# EAGLE design celula_de_carga (EAGLE 9.5.2)
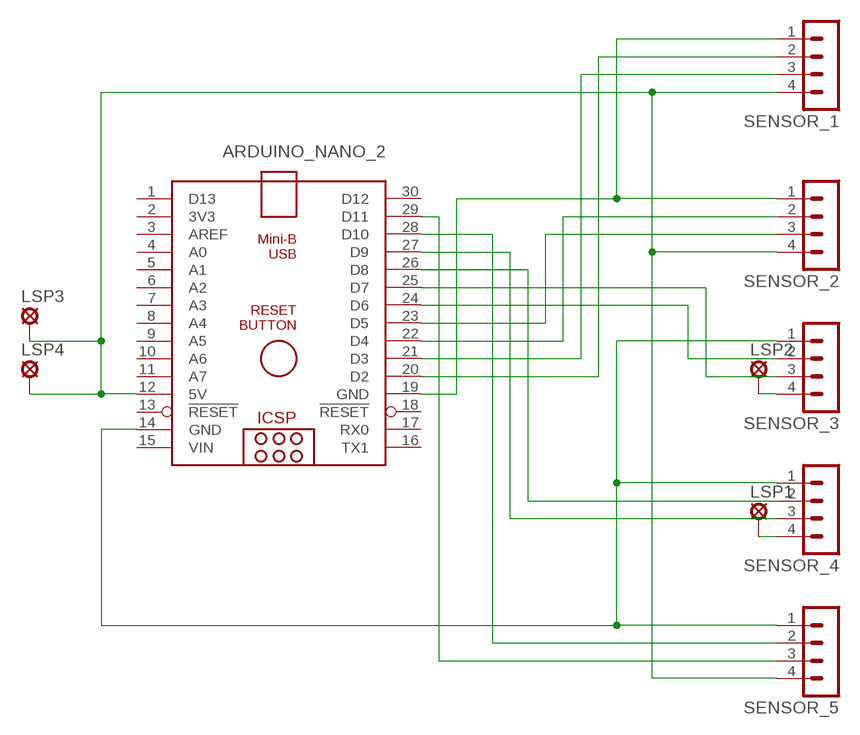
[diagram p0: schematic, sheet 1]

## Parts
ARDUINO_NANO_2  ARDUINO_NANO  [ARDUINO_NANO]
LSP1  LSP10  [LSP10]
LSP2  LSP10  [LSP10]
LSP3  LSP10  [LSP10]
LSP4  LSP10  [LSP10]
SENSOR_1  MA04-1  [MA04-1]
SENSOR_2  MA04-1  [MA04-1]
SENSOR_3  MA04-1  [MA04-1]
SENSOR_4  MA04-1  [MA04-1]
SENSOR_5  MA04-1  [MA04-1]

## Nets
N$1: ARDUINO_NANO_2.14(GND) SENSOR_3.1 SENSOR_4.1 SENSOR_5.1
N$2: ARDUINO_NANO_2.19(GND) SENSOR_1.1 SENSOR_2.1
N$3: ARDUINO_NANO_2.28(D10) SENSOR_5.2
N$4: ARDUINO_NANO_2.20(D2) SENSOR_1.2
N$5: ARDUINO_NANO_2.21(D3) SENSOR_1.3
N$6: ARDUINO_NANO_2.22(D4) SENSOR_2.2
N$7: ARDUINO_NANO_2.23(D5) SENSOR_2.3
N$8: ARDUINO_NANO_2.24(D6) SENSOR_3.2
N$9: ARDUINO_NANO_2.25(D7) SENSOR_3.3
N$10: ARDUINO_NANO_2.26(D8) SENSOR_4.2
N$11: ARDUINO_NANO_2.27(D9) SENSOR_4.3
N$12: ARDUINO_NANO_2.29(D11) SENSOR_5.3
N$13: LSP1.MP SENSOR_4.4
N$14: ARDUINO_NANO_2.12(5V) LSP3.MP LSP4.MP SENSOR_1.4 SENSOR_2.4 SENSOR_5.4
N$15: LSP2.MP SENSOR_3.4
Unconnected: ARDUINO_NANO_2.1(D13) ARDUINO_NANO_2.2(3V3) ARDUINO_NANO_2.3(AREF) ARDUINO_NANO_2.4(A0) ARDUINO_NANO_2.5(A1) ARDUINO_NANO_2.6(A2) ARDUINO_NANO_2.7(A3) ARDUINO_NANO_2.8(A4) ARDUINO_NANO_2.9(A5) ARDUINO_NANO_2.10(A6) ARDUINO_NANO_2.11(A7) ARDUINO_NANO_2.13(!RESET) ARDUINO_NANO_2.16(TX1) ARDUINO_NANO_2.17(RX0) ARDUINO_NANO_2.18(!RESET) ARDUINO_NANO_2.30(D12)

## Power pins joined to a net without a drawn wire
VIN: ARDUINO_NANO_2.15(VIN)

## Library data of the parts
ARDUINO_NANO_2 = ArduinoNanoV30:ARDUINO_NANO: Arduino Nano V3.0 Overview: The Arduino Nano is a small, complete, and breadboard-friendly board based on the ATmega328 (Arduino Nano 3.x) or ATmega168 (Arduino Nano 2.x). It has more or less the same functionality of the Arduino Duemilanove, but in a different package. It lacks only a DC power jack, and works with a Mini-B USB cable instead of a standard one. The Nano was designed and is being produced by Gravitech. Specifications: Microcontroller Atmel ATmega168 or ATmega328 Operating Voltage (logic level) 5 V Input Voltage (recommended) 7-12 V Input Voltage (limits) 6-20 V Digital I/O Pins 14 (of which 6 provide PWM output) Analog Input Pins 8 DC Current per I/O Pin 40 mA Flash Memory 16 KB (ATmega168) or 32 KB (ATmega328) of which 2 KB used by bootloader SRAM 1 KB (ATmega168) or 2 KB (ATmega328) EEPROM 512 bytes (ATmega168) or 1 KB (ATmega328) Clock Speed 16 MHz Dimensions 0.73" x 1.70" Length 45 mm Width 18 mm Weigth 5 g Power: The Arduino Nano can be powered via the Mini-B USB connection, 6-20V unregulated external power supply (pin 30), or 5V regulated external power supply (pin 27). The power source is automatically selected to the highest voltage source. Memory: The ATmega168 has 16 KB of flash memory for storing code (of which 2 KB is used for the bootloader); the ATmega328 has 32 KB, (also with 2 KB used for the bootloader). The ATmega168 has 1 KB of SRAM and 512 bytes of EEPROM (which can be read and written with the EEPROM library); the ATmega328 has 2 KB of SRAM and 1 KB of EEPROM. Input and Output: Each of the 14 digital pins on the Nano can be used as an input or output, using pinMode(), digitalWrite(), and digitalRead() functions. They operate at 5 volts. Each pin can provide or receive a maximum of 40 mA and has an internal pull-up resistor (disconnected by default) of 20-50 kOhms. In addition, some pins have specialized functions. Visit Arduino - ArduinoBoardNano <https://www.arduino.cc/en/Main/ArduinoBoardNano>
LSP1-LSP4 = solpad:LSP10: SOLDER PAD drill 1.0 mm, distributor Buerklin, 12H555
SENSOR_1-SENSOR_5 = con-lstb:MA04-1: PIN HEADER; OC_FARNELL: unknown; OC_NEWARK: unknown

## Board
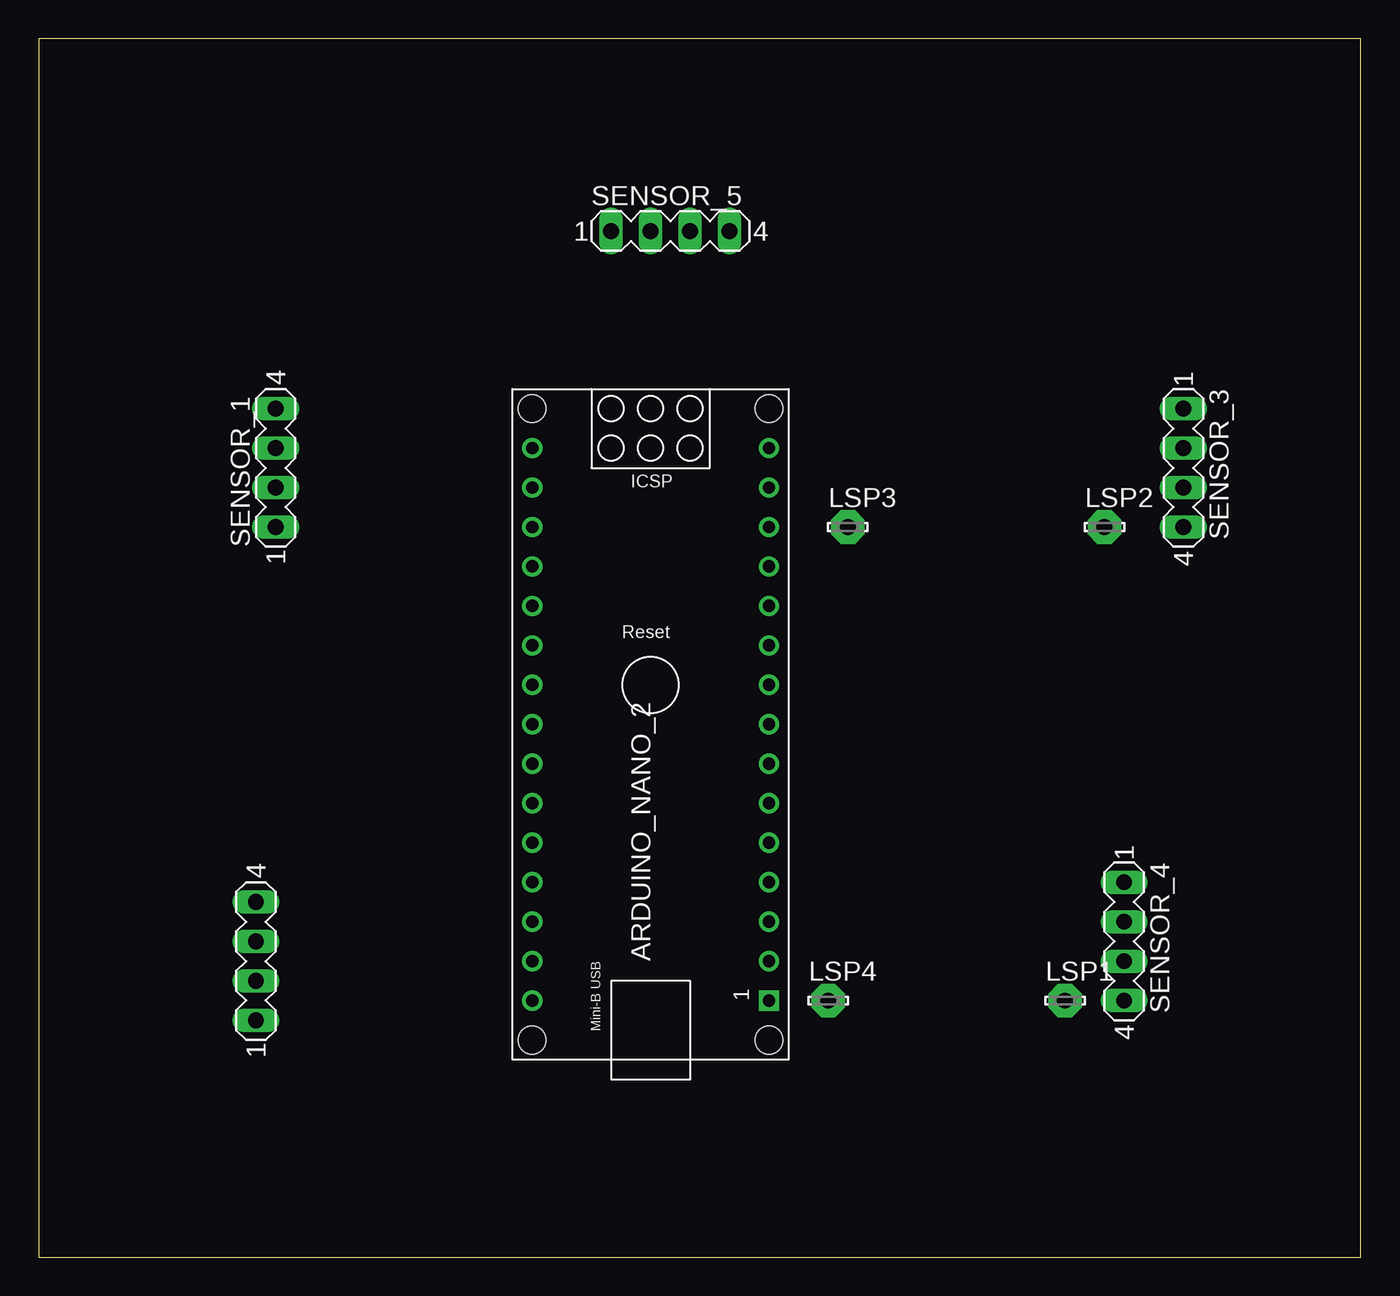
[diagram p1: board, top side]
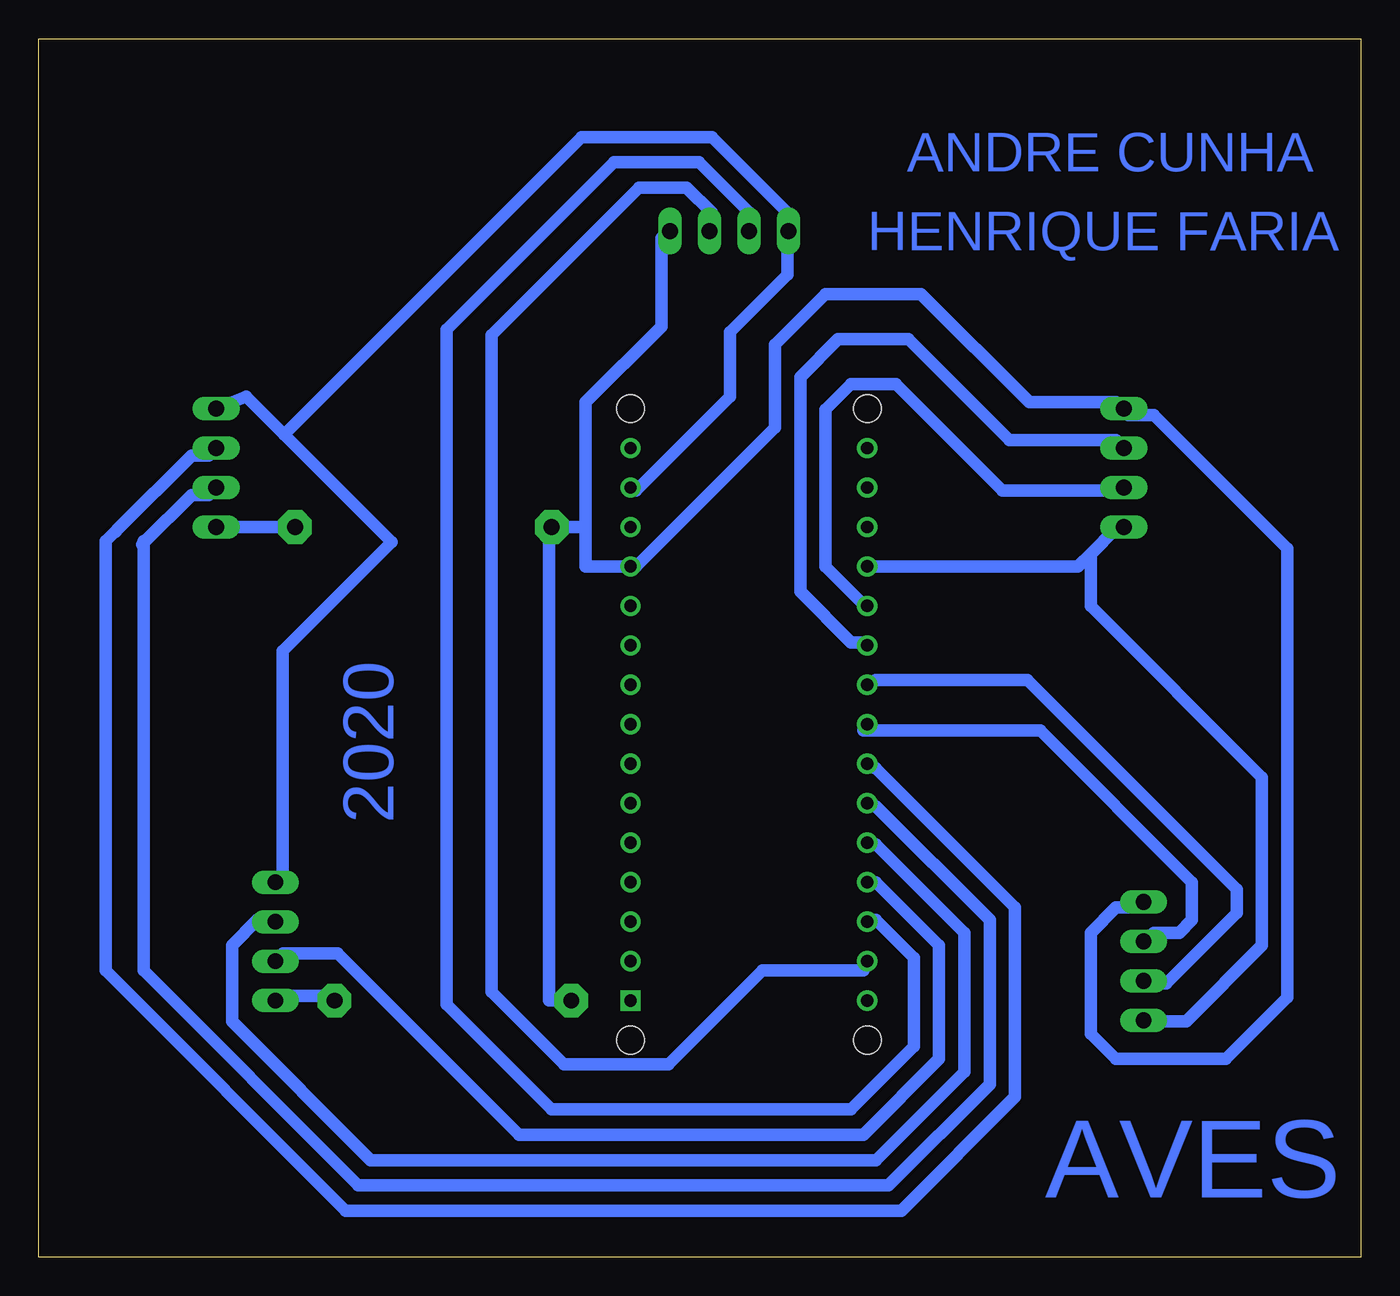
[diagram p2: board, bottom side, seen from below]

Size 85.07 x 78.41 mm. Coordinates in mm from the lower left corner, seen from the top.
Outline: 0,0 85.07,0 85.07,78.41 0,78.41 0,0
Copper layers (1*16): Top 0.035mm / dielectric 1.5mm / Bottom 0.035mm
Design rules "default *": minimum track width 32mil, minimum drill 0.35mm, track to track 32mil, track to pad 32mil, pad to pad 32mil, via to via 32mil, smd to smd 6mil, copper to edge 40mil, drill to drill 32mil, minimum pad ring 10mil, minimum via ring 8mil, stop-mask expansion 4mil, vias tented up to drill 0mil, thermal gap 10mil

### Footprints (pad centres in the part's own frame; a part is rotated, then mirrored left to right if it is on the bottom)
ARDUINO_NANO = drill 0.8 square: 1 -20.32,-7.62 | drill 0.8: 2 -17.78,-7.62; 3 -15.24,-7.62; 4 -12.7,-7.62; 5 -10.16,-7.62; 6 -7.62,-7.62; 7 -5.08,-7.62; 8 -2.54,-7.62; 9 0,-7.62; 10 2.54,-7.62; 11 5.08,-7.62; 12 7.62,-7.62; 13 10.16,-7.62; 14 12.7,-7.62; 15 15.24,-7.62; 16 15.24,7.62; 17 12.7,7.62; 18 10.16,7.62; 19 7.62,7.62; 20 5.08,7.62; 21 2.54,7.62; 22 0,7.62; 23 -2.54,7.62; 24 -5.08,7.62; 25 -7.62,7.62; 26 -10.16,7.62; 27 -12.7,7.62; 28 -15.24,7.62; 29 -17.78,7.62; 30 -20.32,7.62 | hole 1.778: -22.86,-7.62; -22.86,7.62; 17.78,7.62; 17.78,-7.62
LSP10 = drill 1.016 pad 2.159 octagon: MP 0,0
MA04-1 = drill 1.016 long: 1 -3.81,0; 2 -1.27,0; 3 1.27,0; 4 3.81,0

### Placement (x,y rotation side)
ARDUINO_NANO_2  39.37,36.83 90 top
LSP1  66.04,16.51 0 top
LSP2  68.58,46.99 0 top
LSP3  52.07,46.99 0 top
LSP4  50.8,16.51 0 top
SENSOR_1  15.24,50.8 90 top
SENSOR_2  13.97,19.05 90 top
SENSOR_3  73.66,50.8 270 top
SENSOR_4  69.85,20.32 270 top
SENSOR_5  40.64,66.04 0 top

### Tracks (layer width: path | path; a pad name or v marks a point on that pad's centre or on a via)
N$1
  Bottom 0.813: ARDUINO_NANO_2.14 46.63,49.33 40.59,55.37 40.59,59.54 36.88,63.25 36.88,65.58 SENSOR_5.1 36.88,66.4 36.88,67.21 41.76,72.08 50.14,72.08 69.29,52.93 | 72.55,54.93 SENSOR_3.1 71.74,55.38 69.29,52.93 | 69.29,52.93 62.38,46.02 69.39,39.01 69.39,24.13 SENSOR_4.1
N$2
  Bottom 0.813: ARDUINO_NANO_2.19 18.19,44.45 17.37,45.26 | 17.37,45.26 15.75,46.89 SENSOR_1.1 | 17.37,45.26 17.37,41.91 6.35,30.89 6.35,20.07 11.23,15.19 13.31,15.19 SENSOR_2.1
N$3
  Bottom 0.813: ARDUINO_NANO_2.28 31.19,21.69 28.75,19.25 28.75,13.56 32.82,9.5 52.07,9.5 58.83,16.26 58.83,59.69 48.06,70.46 42.57,70.46 39.32,67.21 39.32,66.4 SENSOR_5.2
N$4
  Bottom 0.813: ARDUINO_NANO_2.20 32,42.01 34.44,44.45 34.44,54.56 32.82,56.18 29.92,56.18 23.06,49.33 15.75,49.33 SENSOR_1.2
N$5
  Bottom 0.813: ARDUINO_NANO_2.21 32,39.57 32.82,39.57 36.07,42.82 36.07,56.64 33.63,59.08 29.11,59.08 22.61,52.58 15.75,52.58 SENSOR_1.3
N$6
  Bottom 0.813: ARDUINO_NANO_2.22 31.19,37.14 21.44,37.14 7.98,23.67 7.98,22.15 12.5,17.63 13.31,17.63 SENSOR_2.2
N$7
  Bottom 0.813: ARDUINO_NANO_2.23 32,33.88 20.62,33.88 10.87,24.13 10.87,21.69 11.68,20.88 13.31,20.88 SENSOR_2.3
N$8
  Bottom 0.813: ARDUINO_NANO_2.24 31.19,31.44 22.25,22.5 22.25,10.31 29.57,3 65.33,3 80.77,18.44 80.77,46.08 79.96,46.89 | SENSOR_3.2 74.14,51.59 75.25,51.59 79.96,46.89 | 80.17,46.67 79.96,46.89
N$9
  Bottom 0.813: ARDUINO_NANO_2.25 31.19,29.01 23.88,21.69 23.88,11.12 30.38,4.62 64.52,4.62 78.33,18.44 78.33,46.08 78.28,46.02 | SENSOR_3.3 74.14,49.05 75.25,49.05 78.28,46.02 | 78.42,45.88 78.28,46.02
N$10
  Bottom 0.813: ARDUINO_NANO_2.26 31.19,26.57 25.5,20.88 25.5,11.94 31.19,6.25 63.7,6.25 72.64,15.19 72.64,20.07 71.02,21.69 70.21,21.69 SENSOR_4.2
N$11
  Bottom 0.813: ARDUINO_NANO_2.27 31.19,24.13 27.13,20.07 27.13,12.75 32,7.87 54.15,7.87 65.84,19.56 69.34,19.56 SENSOR_4.3
N$12
  Bottom 0.813: ARDUINO_NANO_2.29 32,18.44 38.51,18.44 44.55,12.39 51.26,12.39 55.93,17.07 55.93,59.33 46.43,68.83 43.38,68.83 41.76,67.21 41.76,66.4 SENSOR_5.3
N$13
  Bottom 0.813: SENSOR_4.4 69.39,16.82 66.14,16.82 LSP1.MP
N$14
  Bottom 0.813: 49.89,46.99 LSP3.MP 52.22,46.53 52.22,16.51 LSP4.MP | 49.89,46.99 49.89,44.45 ARDUINO_NANO_2.12 46.63,44.45 37.69,53.39 37.69,58.72 34.44,61.98 28.3,61.98 21.34,55.02 15.75,55.02 SENSOR_1.4 14.93,54.2 13.31,54.2 4.72,45.62 4.72,16.71 8.69,12.75 15.75,12.75 17.37,14.38 17.37,20.88 15.75,22.5 14.12,22.5 SENSOR_2.4 | 49.89,46.99 49.89,55.02 45.01,59.89 45.01,65.58 SENSOR_5.4
N$15
  Bottom 0.813: LSP2.MP SENSOR_3.4

### Text on the board
Bottom: ANDRE CUNHA | HENRIQUE FARIA | 2020 | AVES